# Altium project MFU 1.00.PrjPcb
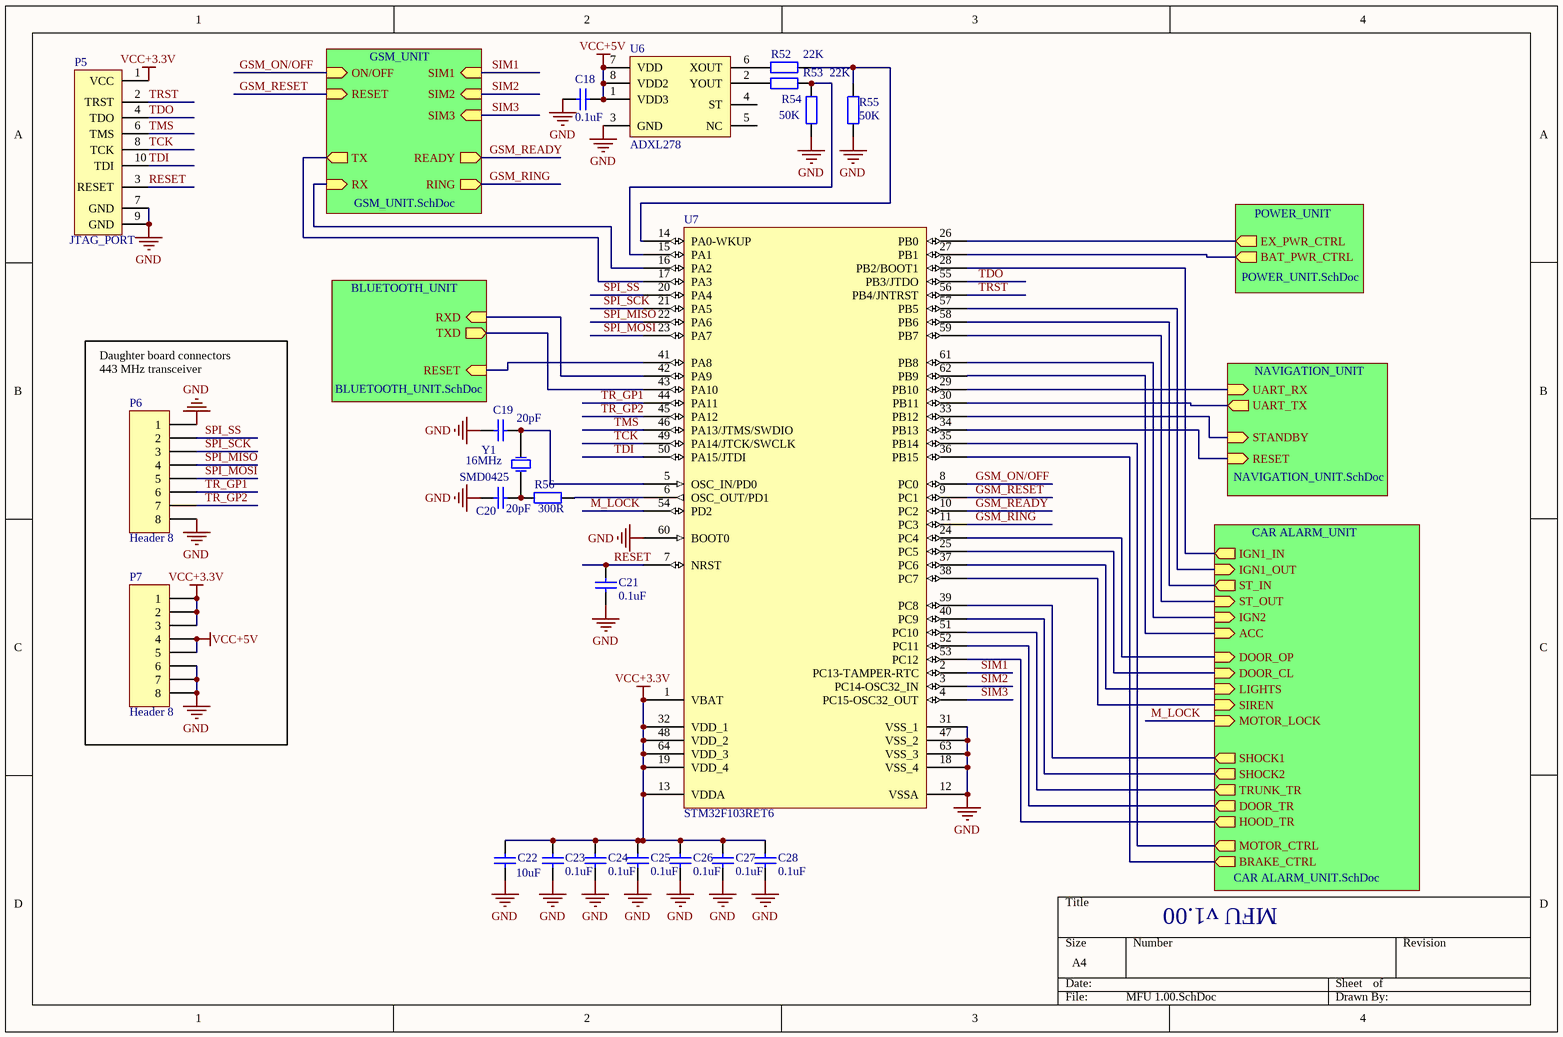
[diagram p0: MFU 1.00.SchDoc]
6 sheets, 195 parts. Net scope: hierarchical (ports join the sheet entries above them; power ports are global).
Board file: MFU 1.00.PcbDoc
Sheets:
  MFU 1.00.SchDoc
    POWER_UNIT = POWER_UNIT.SchDoc
    GSM_UNIT = GSM_UNIT.SchDoc
    NAVIGATION_UNIT = NAVIGATION_UNIT.SchDoc
    BLUETOOTH_UNIT = BLUETOOTH_UNIT.SchDoc
    CAR ALARM_UNIT = CAR ALARM_UNIT.SchDoc

## Sheet MFU 1.00.SchDoc
size A4

### Parts
C18  value 0.1uF  [C0603]  (hidden comment: 0805)
C19  value 20pF  [C0603]  (hidden comment: 0805)
C20  value 20pF  [C0603]  (hidden comment: 0805)
C21  value 0.1uF  [C0603]  (hidden comment: 0805)
C22  value 10uF  [C1210]  (hidden comment: Cap Semi)
C23  value 0.1uF  [C0603]  (hidden comment: 0805)
C24  value 0.1uF  [C0603]  (hidden comment: 0805)
C25  value 0.1uF  [C0603]  (hidden comment: 0805)
C26  value 0.1uF  [C0603]  (hidden comment: 0805)
C27  value 0.1uF  [C0603]  (hidden comment: 0805)
C28  value 0.1uF  [C0603]  (hidden comment: 0805)
P5  JTAG_PORT  [JTAG_connector]
P6  Header 8  [HDR1X8]
P7  Header 8  [HDR1X8]
R52  value 22K  [C0603]  (hidden comment: RES)
R53  value 22K  [C0603]  (hidden comment: RES)
R54  value 50K  [C0603]  (hidden comment: RES)
R55  value 50K  [C0603]  (hidden comment: RES)
R56  value 300R  [C0603]  (hidden comment: RES)
U6  ADXL278  [ADXL278]
U7  STM32F103RET6  [LQFP64_M]
Y1  SMD0425  value 16MHz  [QUARTZ_SMD0425]

### Sub-sheets
BLUETOOTH_UNIT = BLUETOOTH_UNIT.SchDoc: RXD (in), TXD (out), RESET (in)
CAR ALARM_UNIT = CAR ALARM_UNIT.SchDoc: IGN1_IN (out), ST_IN (out), ST_OUT (in), IGN1_OUT (in), IGN2 (in), ACC (in), DOOR_OP (in), DOOR_CL (in), MOTOR_LOCK (in), SIREN (in), LIGHTS (in), MOTOR_CTRL (out), HOOD_TR (out), SHOCK1 (out), SHOCK2 (out), TRUNK_TR (out), DOOR_TR (out), BRAKE_CTRL (out)
GSM_UNIT = GSM_UNIT.SchDoc: SIM1 (in), SIM2 (in), SIM3 (in), ON/OFF (in), RESET (in), READY (out), RING (out), TX (out), RX (in)
NAVIGATION_UNIT = NAVIGATION_UNIT.SchDoc: UART_RX (in), STANDBY (in), RESET (in), UART_TX (out)
POWER_UNIT = POWER_UNIT.SchDoc: EX_PWR_CTRL (out), BAT_PWR_CTRL (out)

### Nets
GND: C18.1 C19.2 C20.2 C21.1 C22.1 C23.1 C24.1 C25.1 C26.1 C27.1 C28.1 P5.7(GND) P5.9(GND) P6.1 P6.8 P7.6 P7.7 P7.8 R54.2 R55.2 U6.3(GND) U7.12(VSSA) U7.18(VSS_4) U7.31(VSS_1) U7.47(VSS_2) U7.60(BOOT0) U7.63(VSS_3)
VCC+3.3V: C22.2 C23.2 C24.2 C25.2 C26.2 C27.2 C28.2 P5.1(VCC) P7.1 P7.2 P7.3 U7.1(VBAT) U7.13(VDDA) U7.19(VDD_4) U7.32(VDD_1) U7.48(VDD_2) U7.64(VDD_3)
VCC+5V: C18.2 P7.4 P7.5 U6.1(VDD3) U6.7(VDD) U6.8(VDD2)
GSM_ON/OFF: U7.8(PC0) ; sheet GSM_UNIT/ON/OFF
GSM_READY: U7.10(PC2) ; sheet GSM_UNIT/READY
GSM_RESET: U7.9(PC1) ; sheet GSM_UNIT/RESET
GSM_RING: U7.11(PC3) ; sheet GSM_UNIT/RING
M_LOCK: U7.54(PD2) ; sheet CAR ALARM_UNIT/MOTOR_LOCK
RESET: C21.2 P5.3(RESET) U7.7(NRST)
SIM1: U7.2(PC13-TAMPER-RTC) ; sheet GSM_UNIT/SIM1
SIM2: U7.3(PC14-OSC32_IN) ; sheet GSM_UNIT/SIM2
SIM3: U7.4(PC15-OSC32_OUT) ; sheet GSM_UNIT/SIM3
SPI_MISO: P6.4 U7.22(PA6)
SPI_MOSI: P6.5 U7.23(PA7)
SPI_SCK: P6.3 U7.21(PA5)
SPI_SS: P6.2 U7.20(PA4)
TCK: P5.8(TCK) U7.49(PA14/JTCK/SWCLK)
TDI: P5.10(TDI) U7.50(PA15/JTDI)
TDO: P5.4(TDO) U7.55(PB3/JTDO)
TMS: P5.6(TMS) U7.46(PA13/JTMS/SWDIO)
TR_GP1: P6.6 U7.44(PA11)
TR_GP2: P6.7 U7.45(PA12)
TRST: P5.2(TRST) U7.56(PB4/JNTRST)
NetC7_1: U7.28(PB2/BOOT1) ; sheet CAR ALARM_UNIT/IGN1_IN
NetC8_1: U7.58(PB6) ; sheet CAR ALARM_UNIT/ST_IN
NetC9_1: U7.35(PB14) ; sheet CAR ALARM_UNIT/MOTOR_CTRL
NetC10_1: U7.36(PB15) ; sheet CAR ALARM_UNIT/BRAKE_CTRL
NetC11_1: U7.53(PC12) ; sheet CAR ALARM_UNIT/HOOD_TR
NetC12_1: U7.52(PC11) ; sheet CAR ALARM_UNIT/DOOR_TR
NetC13_1: U7.51(PC10) ; sheet CAR ALARM_UNIT/TRUNK_TR
NetC14_1: U7.39(PC8) ; sheet CAR ALARM_UNIT/SHOCK1
NetC15_1: U7.40(PC9) ; sheet CAR ALARM_UNIT/SHOCK2
NetC19_1: C19.1 U7.5(OSC_IN/PD0) Y1.3(OSC2)
NetC20_1: C20.1 R56.1 Y1.1(OSC1)
NetQ13_3: U7.17(PA3) ; sheet GSM_UNIT/TX
NetQ14_3: U7.16(PA2) ; sheet GSM_UNIT/RX
NetR6_2: U7.57(PB5) ; sheet CAR ALARM_UNIT/IGN1_OUT
NetR7_2: U7.61(PB8) ; sheet CAR ALARM_UNIT/IGN2
NetR8_2: U7.62(PB9) ; sheet CAR ALARM_UNIT/ACC
NetR14_2: U7.25(PC5) ; sheet CAR ALARM_UNIT/DOOR_CL
NetR16_2: U7.24(PC4) ; sheet CAR ALARM_UNIT/DOOR_OP
NetR22_2: U7.59(PB7) ; sheet CAR ALARM_UNIT/ST_OUT
NetR36_2: U7.38(PC7) ; sheet CAR ALARM_UNIT/SIREN
NetR40_2: U7.37(PC6) ; sheet CAR ALARM_UNIT/LIGHTS
NetR52_1: R52.1 R55.1 U7.14(PA0-WKUP)
NetR52_2: R52.2 U6.6(XOUT)
NetR53_1: R53.1 R54.1 U7.15(PA1)
NetR53_2: R53.2 U6.2(YOUT)
NetR56_2: R56.2 U7.6(OSC_OUT/PD1)
NetR57_1: U7.29(PB10) ; sheet NAVIGATION_UNIT/UART_RX
NetR58_1: U7.30(PB11) ; sheet NAVIGATION_UNIT/UART_TX
NetR59_1: U7.33(PB12) ; sheet NAVIGATION_UNIT/STANDBY
NetR60_1: U7.34(PB13) ; sheet NAVIGATION_UNIT/RESET
NetR63_1: U7.26(PB0) ; sheet POWER_UNIT/EX_PWR_CTRL
NetR70_1: U7.27(PB1) ; sheet POWER_UNIT/BAT_PWR_CTRL
NetU1_2: U7.41(PA8) ; sheet BLUETOOTH_UNIT/RESET
NetU1_12: U7.42(PA9) ; sheet BLUETOOTH_UNIT/RXD
NetU1_13: U7.43(PA10) ; sheet BLUETOOTH_UNIT/TXD

Not connected (* = marked no-connect by the designer): U6 4(ST) 5(NC)

### Notes on the sheet
- (near P6) Daughter board connectors
  443 MHz transceiver
- MFU v1.00

### Library data of the parts
C18-C21 C23-C28 = Capasitor_SMD_0805: Capasitor_SMD_0808/
C22 = Cap Semi: Capacitor (Semiconductor SIM Model); Published: 8-Jun-2000; LatestRevisionDate: 29-May-2009; LatestRevisionNote: IPC-7351 Footprint Added.; PackageReference: C1206; Publisher: Altium Limited; PackageDescription: Chip Capacitor
P6 P7 = Header 8: Header, 8-Pin; LatestRevisionDate: 17-Jul-2002; LatestRevisionNote: Re-released for DXP Platform.; Publisher: Altium Limited
R52-R56 = RES: Resistor
U7 = STM32F103RBT6: STM32 ARM-based 32-bit MCU with 512 Kbytes Flash, 64-pin LQFP, Industrial Temperature; Published: 30-May-2008; DatasheetVersion: rev6, Mar-2008; PackageVersion: Mar-2008; PackageReference: LQFP64; Publisher: Altium Limited; PackageDescription: 64-Pin Low-Profile Quad Flat Pack, 10 x 10 mm Body, 0.5 mm Pitch (LQFP64); ComponentLink1Description: Manufacturer Link; ComponentLink1URL: www.st.com/stm32; ComponentLink2Description: Datasheet; ComponentLink2URL: http://www.st.com/stonline/products/literature/ds/13587.pdf
Y1 = Quartz_SMD

## Sheet POWER_UNIT.SchDoc
size A4
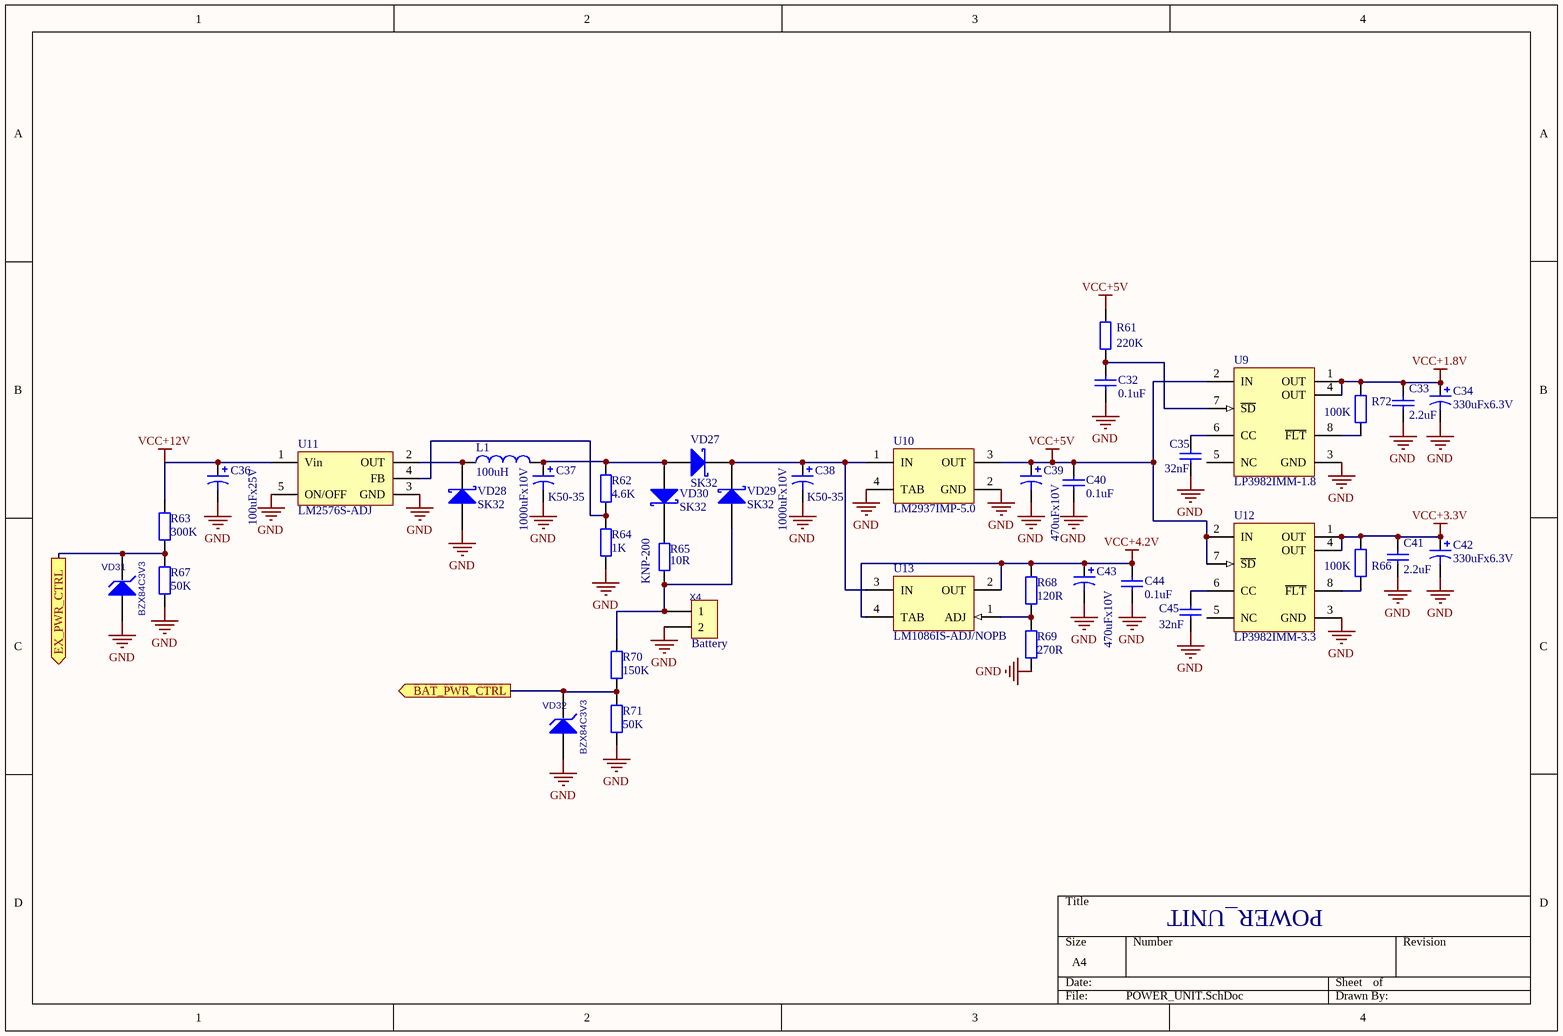
[diagram p1: POWER_UNIT.SchDoc]

### Parts
C32  value 0.1uF  [C0603]  (hidden comment: 0805)
C33  value 2.2uF  [C0603]  (hidden comment: 0805)
C34  value 330uFx6.3V  [Capasitor_POL_SMD D6.3]  (hidden comment: SMD_cap)
C35  value 32nF  [C0603]  (hidden comment: 0805)
C36  value 100uFx25V  [CAP_POL_D6.3]  (hidden comment: K50-35)
C37  K50-35  value 1000uFx10V  [CAP_POL_D10]
C38  K50-35  value 1000uFx10V  [CAP_POL_D10]
C39  value 470uFx10V  [Capasitor_POL_SMD D8]  (hidden comment: SMD_cap)
C40  value 0.1uF  [C0603]  (hidden comment: 0805)
C41  value 2.2uF  [C0603]  (hidden comment: 0805)
C42  value 330uFx6.3V  [Capasitor_POL_SMD D6.3]  (hidden comment: SMD_cap)
C43  value 470uFx10V  [Capasitor_POL_SMD D8]  (hidden comment: SMD_cap)
C44  value 0.1uF  [C0603]  (hidden comment: 0805)
C45  value 32nF  [C0603]  (hidden comment: 0805)
L1  value 100uH  [Inductor_SMD_12.5x12.5]  (hidden comment: B82477P4)
R61  value 220K  [C0603]  (hidden comment: RES)
R62  value 4.6K  [C0603]  (hidden comment: RES)
R63  value 300K  [C0603]  (hidden comment: RES)
R64  value 1K  [C0603]  (hidden comment: RES)
R65  KNP-200  value 10R  [Resistor KNP-200]
R66  value 100K  [C0603]  (hidden comment: RES)
R67  value 50K  [C0603]  (hidden comment: RES)
R68  value 120R  [C0805]  (hidden comment: RES)
R69  value 270R  [C0805]  (hidden comment: RES)
R70  value 150K  [C0603]  (hidden comment: RES)
R71  value 50K  [C0603]  (hidden comment: RES)
R72  value 100K  [C0603]  (hidden comment: RES)
U9  LP3982IMM-1.8  [MUA08A_N]
U10  LM2937IMP-5.0  [MP04A_N]
U11  LM2576S-ADJ  [TO-263-5]
U12  LP3982IMM-3.3  [MUA08A_N]
U13  LM1086IS-ADJ/NOPB  [TS3B_N]
VD27  SK32  [SMC]
VD28  SK32  [SMC]
VD29  SK32  [SMC]
VD30  SK32  [SMC]
VD31  BZX84C3V3  [SOT23]
VD32  BZX84C3V3  [SOT23]
X4  value Battery  [DG350-3.5-2P]  (hidden comment: DG350-3.5-2P)

### Ports
BAT_PWR_CTRL (out), EX_PWR_CTRL (out)

### Nets
GND: C32.2 C33.2 C34.2 C35.2 C36.2 C37.2 C38.2 C39.2 C40.2 C41.2 C42.2 C43.2 C44.2 C45.2 R64.1 R67.1 R69.1 R71.1 U9.3(GND) U10.2(GND) U10.4(TAB) U11.3(GND) U11.5(ON/OFF) U12.3(GND) VD28.2(A) VD31.1(A) VD32.1(A) X4.2
VCC+1.8V: C33.1 C34.1 R72.2 U9.1(OUT) U9.4(OUT)
VCC+3.3V: C41.1 C42.1 R66.2 U12.1(OUT) U12.4(OUT)
VCC+4.2V: C43.1 C44.1 R68.2 U13.2(OUT) U13.4(TAB)
VCC+5V: C39.1 C40.1 R61.2 U9.2(IN) U10.3(OUT) U12.2(IN) U12.7(~{SD})
VCC+12V: C36.1 R63.2 U11.1(Vin)
NetC32_1: C32.1 R61.1 U9.7(~{SD})
NetC35_1: C35.1 U9.6(CC)
NetC37_1: C37.1 L1.2 R62.2 VD27.2(A) VD30.2(A)
NetC38_1: C38.1 U10.1(IN) U13.3(IN) VD27.1(K) VD29.1(K)
NetC45_1: C45.1 U12.6(CC)
NetL1_1: L1.1 U11.2(OUT) VD28.1(K)
NetR62_1: R62.1 R64.2 U11.4(FB)
NetR63_1: R63.1 R67.2 VD31.3(K) ; port EX_PWR_CTRL
NetR65_1: R65.1 R70.2 VD29.2(A) X4.1
NetR65_2: R65.2 VD30.1(K)
NetR66_1: R66.1 U12.8(~{FLT})
NetR68_1: R68.1 R69.2 U13.1(ADJ)
NetR70_1: R70.1 R71.2 VD32.3(K) ; port BAT_PWR_CTRL
NetR72_1: R72.1 U9.8(~{FLT})

Not connected (* = marked no-connect by the designer): U9 5(NC); U12 5(NC); VD31 2; VD32 2

### Notes on the sheet
- POWER_UNIT

### Library data of the parts
C32 C33 C35 C40 C41 C44 C45 = Capasitor_SMD_0805: Capasitor_SMD_0808/
C34 C42 = Capasitor_POL_SMD D8.0
C36 = Capasitor_pol D6.3
C37 C38 = Capasitor_pol D10
C39 C43 = Capasitor_POL_SMD D8.0: size 8x10.5
R61-R64 R66-R72 = RES: Resistor
R65 = Resistor 2W
U9 = LP3982IMM-1.8: Micropower, Ultra Low-Dropout, Low-Noise, 300mA CMOS Regulator, 8-pin Mini SOIC; Manufacturer: National Semiconductor; PackageTopMarking: ZXTT*LENB; PowerWise: N; CompType: LDO IC; Published: 4-Dec-2008; DatasheetVersion: Mar-2006; PackageVersion: revF, Apr-2008; PackageReference: MUA08A; Publisher: Altium Limited; PackageDescription: MINI SOIC, .118 x .118 x .034in, 8 Lead, .0256in Pitch; PartNumber: LP3982IMM-1.8; RoHS: N; PinCount: 8; Code_JEDEC: MO-187-AA; ComponentLink1Description: LP3982 Datasheet; ComponentLink1URL: http://www.national.com/ds/LP/LP3982.pdf; ComponentLink2Description: LP3982 Web Page; ComponentLink2URL: http://www.national.com/pf/LP/LP3982.html; ComponentLink3Description: MUA08A Package Page; ComponentLink3URL: http://www.national.com/packaging/folders/mua08a.html
U10 = LM2937IMP-5.0: 500 mA Low Dropout Regulator, 4-pin SOT-223; Manufacturer: National Semiconductor; PackageTopMarking: XYTT*L71B; PowerWise: N; CompType: LDO IC; Published: 4-Dec-2008; DatasheetVersion: Aug-2005; PackageVersion: revB, Apr-2003; PackageReference: MP04A; Publisher: Altium Limited; PackageDescription: Molded SOT-223, 6.50 x 3.56 x 1.6mm Body, 4 Lead, 2.3mm Pitch; Supplier 1: Farnell; Supplier Part Number 1: 3331209; PartNumber: LM2937IMP-5.0; RoHS: N; PinCount: 4; Code_JEDEC: TO-261-AA; Code_IPC: SOT223-4; ComponentLink1Description: LM2937 Datasheet; ComponentLink1URL: http://www.national.com/ds/LM/LM2937.pdf; ComponentLink2Description: LM2937 Web Page; ComponentLink2URL: http://www.national.com/pf/LM/LM2937.html; ComponentLink3Description: MP04A Package Page; ComponentLink3URL: http://www.national.com/packaging/folders/mp04a.html
U12 = LP3982IMM-3.3: Micropower, Ultra Low-Dropout, Low-Noise, 300mA CMOS Regulator, 8-pin Mini SOIC; Manufacturer: National Semiconductor; PackageTopMarking: ZXTT*LEUB; PowerWise: N; CompType: LDO IC; Published: 4-Dec-2008; DatasheetVersion: Mar-2006; PackageVersion: revF, Apr-2008; PackageReference: MUA08A; Publisher: Altium Limited; PackageDescription: MINI SOIC, .118 x .118 x .034in, 8 Lead, .0256in Pitch; Supplier 1: Farnell; Supplier Part Number 1: 9779590; PartNumber: LP3982IMM-3.3; RoHS: N; PinCount: 8; Code_JEDEC: MO-187-AA; ComponentLink1Description: LP3982 Datasheet; ComponentLink1URL: http://www.national.com/ds/LP/LP3982.pdf; ComponentLink2Description: LP3982 Web Page; ComponentLink2URL: http://www.national.com/pf/LP/LP3982.html; ComponentLink3Description: MUA08A Package Page; ComponentLink3URL: http://www.national.com/packaging/folders/mua08a.html
U13 = LM1086IS-ADJ/NOPB: 1.5A Low Dropout Positive Regulators, 3-pin TO-263, Pb-Free; Manufacturer: National Semiconductor; PackageTopMarking: NSUZXYTTE#*LM1086*IS-ADJ; PowerWise: N; CompType: LDO IC; Published: 1-Mar-2010; DatasheetVersion: Jun-2005; PackageVersion: revF, Apr-2005; PackageReference: TS3B; Publisher: Altium Limited; PackageDescription: TO-263, Molded, .400 x .390 x .180in, 3 Lead, .1in Pitch, Surface Mount; Supplier 1: Digi-Key; Supplier Part Number 1: LM1086IS-ADJ-ND; Supplier 2: Farnell; Supplier Part Number 2: 1469045; PartNumber: LM1086IS-ADJ/NOPB; RoHS: Y; PinCount: 3; Code_JEDEC: MO-169-AA; ComponentLink1Description: LM1086 Datasheet; ComponentLink1URL: http://www.national.com/ds/LM/LM1086.pdf; ComponentLink2Description: LM1086 Web Page; ComponentLink2URL: http://www.national.com/pf/LM/LM1086.html; ComponentLink3Description: TS3B Package Page; ComponentLink3URL: http://www.national.com/packaging/folders/ts3b.html
VD31 VD32 = BZX84C: Value: *

## Sheet GSM_UNIT.SchDoc
size A4
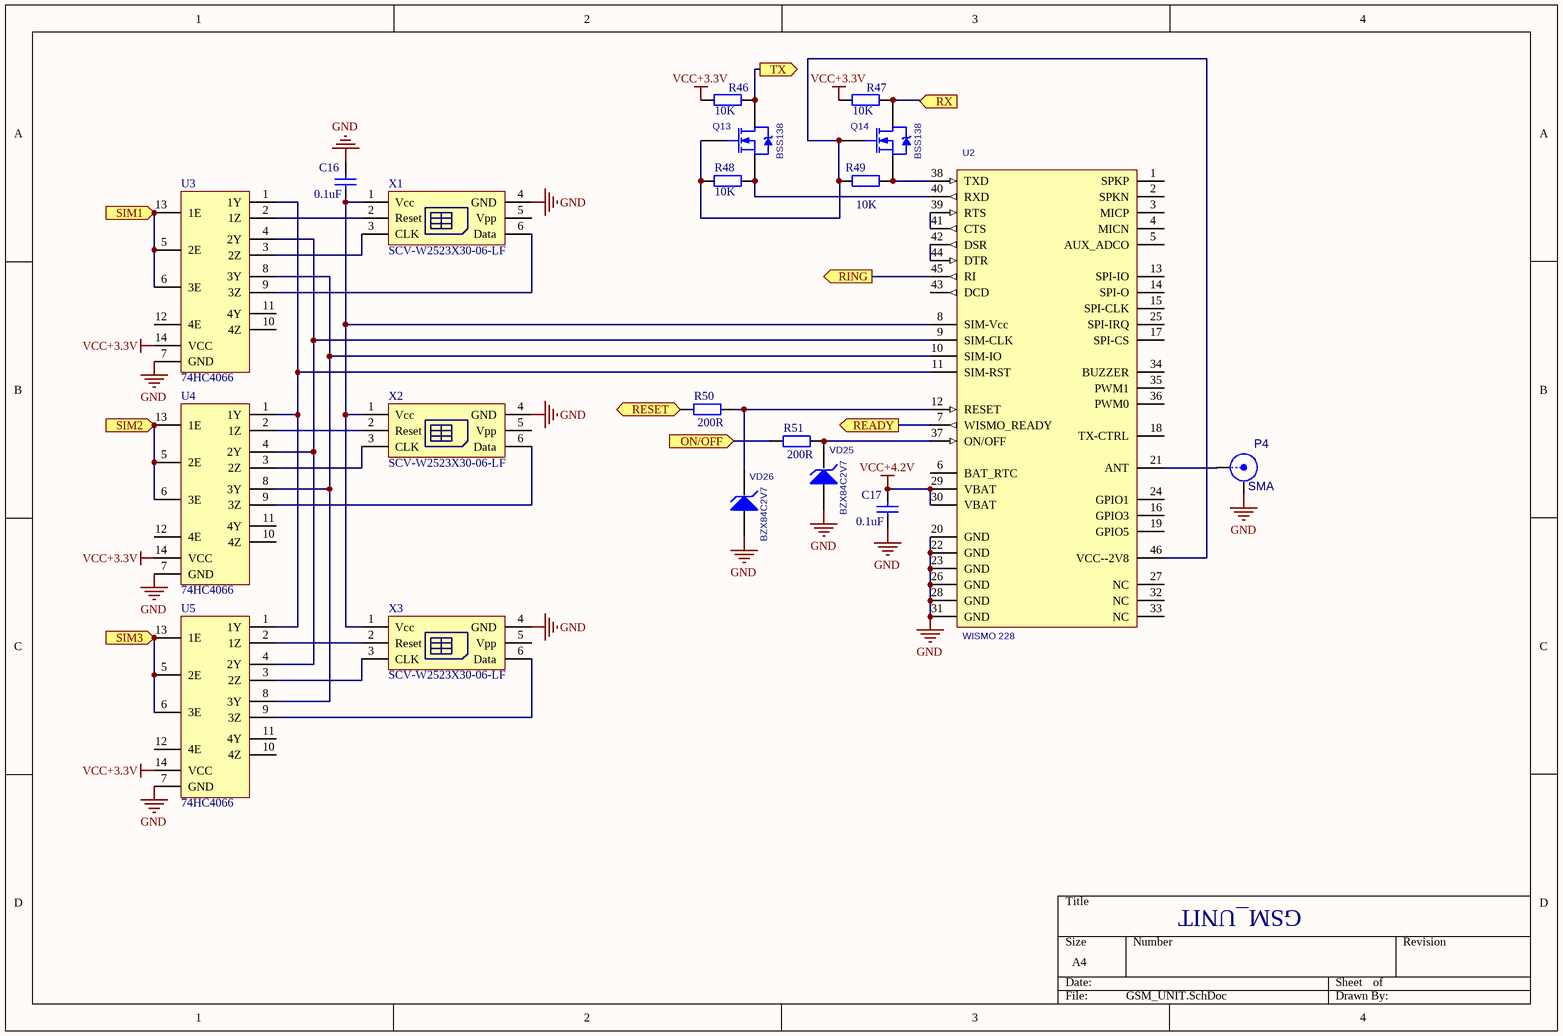
[diagram p2: GSM_UNIT.SchDoc]

### Parts
C16  value 0.1uF  [C0603]  (hidden comment: 0805)
C17  value 0.1uF  [C0603]  (hidden comment: 0805)
P4  SMA  [SMA]
Q13  BSS138  [SOT23]
Q14  BSS138  [SOT23]
R46  value 10K  [C0603]  (hidden comment: RES)
R47  value 10K  [C0603]  (hidden comment: RES)
R48  value 10K  [C0603]  (hidden comment: RES)
R49  value 10K  [C0603]  (hidden comment: RES)
R50  value 200R  [C0603]  (hidden comment: RES)
R51  value 200R  [C0603]  (hidden comment: RES)
U2  WISMO 228  [WISMO]
U3  74HC4066  [SO-14]
U4  74HC4066  [SO-14]
U5  74HC4066  [SO-14]
VD25  BZX84C2V7  [SOT23]
VD26  BZX84C2V7  [SOT23]
X1  SCV-W2523X30-06-LF  [SCV-W2523X30-06-LF]
X2  SCV-W2523X30-06-LF  [SCV-W2523X30-06-LF]
X3  SCV-W2523X30-06-LF  [SCV-W2523X30-06-LF]

### Ports
ON/OFF (in), READY (out), RESET (in), RING (out), RX (in), SIM1 (in), SIM2 (in), SIM3 (in), TX (out)

### Nets
GND: C16.1 C17.2 P4.2(Y) U2.20(GND) U2.22(GND) U2.23(GND) U2.26(GND) U2.28(GND) U2.31(GND) U3.7(GND) U4.7(GND) U5.7(GND) VD25.1(A) VD26.1(A) X1.4(GND) X2.4(GND) X3.4(GND)
VCC+3.3V: R46.1 R47.1 U3.14(VCC) U4.14(VCC) U5.14(VCC)
VCC+4.2V: C17.1 U2.29(VBAT) U2.30(VBAT)
GSM_ON/OFF: R51.1 ; port ON/OFF
GSM_READY: U2.7(WISMO_READY) ; port READY
GSM_RESET: R50.1 ; port RESET
GSM_RING: U2.45(RI) ; port RING
SIM1: U3.5(2E) U3.6(3E) U3.13(1E) ; port SIM1
SIM2: U4.5(2E) U4.6(3E) U4.13(1E) ; port SIM2
SIM3: U5.5(2E) U5.6(3E) U5.13(1E) ; port SIM3
NetC16_2: C16.2 U2.8(SIM-Vcc) X1.1(Vcc) X2.1(Vcc) X3.1(Vcc)
NetP4_1: P4.1(X) U2.21(ANT)
NetQ13_1: Q13.1(G) Q14.1(G) R48.1 R49.1 U2.46(VCC--2V8)
NetQ13_2: Q13.2(S) R48.2 U2.40(RXD)
NetQ13_3: Q13.3(D) R46.2 ; port TX
NetQ14_2: Q14.2(S) R49.2 U2.38(TXD)
NetQ14_3: Q14.3(D) R47.2 ; port RX
NetR50_2: R50.2 U2.12(RESET) VD26.3(K)
NetR51_2: R51.2 U2.37(ON/OFF) VD25.3(K)
NetU2_9: U2.9(SIM-CLK) U3.4(2Y) U4.4(2Y) U5.4(2Y)
NetU2_10: U2.10(SIM-IO) U3.8(3Y) U4.8(3Y) U5.8(3Y)
NetU2_11: U2.11(SIM-RST) U3.1(1Y) U4.1(1Y) U5.1(1Y)
NetU2_39: U2.39(RTS) U2.41(CTS)
NetU2_42: U2.42(DSR) U2.44(DTR)
NetU3_2: U3.2(1Z) X1.2(Reset)
NetU3_3: U3.3(2Z) X1.3(CLK)
NetU3_9: U3.9(3Z) X1.6(Data)
NetU4_2: U4.2(1Z) X2.2(Reset)
NetU4_3: U4.3(2Z) X2.3(CLK)
NetU4_9: U4.9(3Z) X2.6(Data)
NetU5_2: U5.2(1Z) X3.2(Reset)
NetU5_3: U5.3(2Z) X3.3(CLK)
NetU5_9: U5.9(3Z) X3.6(Data)

Not connected (* = marked no-connect by the designer): U2 1(SPKP) 2(SPKN) 3(MICP) 4(MICN) 5(AUX_ADCO) 6(BAT_RTC) 13(SPI-IO) 14(SPI-O) 15(SPI-CLK) 16(GPIO3) 17(SPI-CS) 18(TX-CTRL) 19(GPIO5) 24(GPIO1) 25(SPI-IRQ) 27(NC) 32(NC) 33(NC) 34(BUZZER) 35(PWM1) 36(PWM0) 43(DCD); U3 10(4Z) 11(4Y) 12(4E); U4 10(4Z) 11(4Y) 12(4E); U5 10(4Z) 11(4Y) 12(4E); VD25 2; VD26 2; X1 5(Vpp); X2 5(Vpp); X3 5(Vpp)

### Notes on the sheet
- GSM_UNIT

### Library data of the parts
C16 C17 = Capasitor_SMD_0805: Capasitor_SMD_0808/
Q13 Q14 = BSS138-SOT23
R46-R51 = RES: Resistor
VD25 VD26 = BZX84C: Value: *
X1-X3 = SCV-W2523X30-06-LF: SIM Cartreader
P4 = SMA: LatestRevisionDate: 17-Jul-2002; Publisher: Altium Limited; LatestRevisionNote: Re-released for DXP Platform.; Value: *

## Sheet NAVIGATION_UNIT.SchDoc
size A4
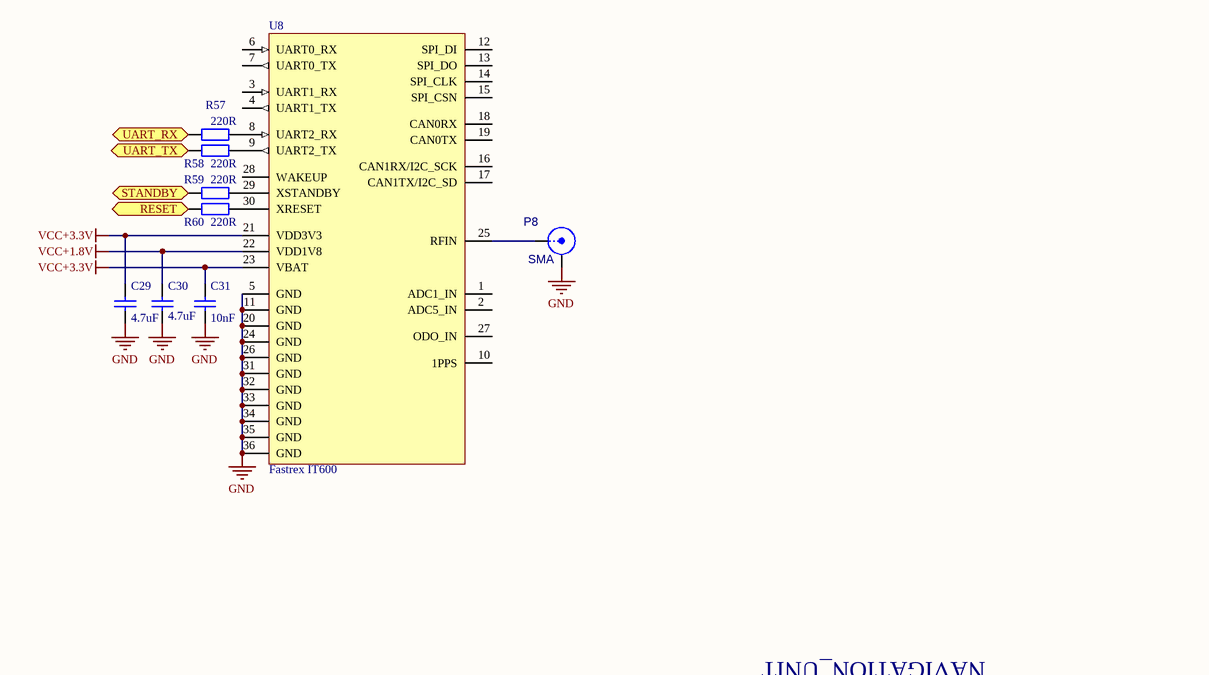
[diagram p3: NAVIGATION_UNIT.SchDoc]

### Parts
C29  value 4.7uF  [C0805]  (hidden comment: 0805)
C30  value 4.7uF  [C0805]  (hidden comment: 0805)
C31  value 10nF  [C0603]  (hidden comment: 0805)
P8  SMA  [SMA]
R57  value 220R  [C0603]  (hidden comment: RES)
R58  value 220R  [C0603]  (hidden comment: RES)
R59  value 220R  [C0603]  (hidden comment: RES)
R60  value 220R  [C0603]  (hidden comment: RES)
U8  Fastrex IT600  [Fastrex_IT600]

### Ports
RESET (in), STANDBY (in), UART_RX (in), UART_TX (out)

### Nets
GND: C29.2 C30.2 C31.2 P8.2(Y) U8.5(GND) U8.11(GND) U8.20(GND) U8.24(GND) U8.26(GND) U8.31(GND) U8.32(GND) U8.33(GND) U8.34(GND) U8.35(GND) U8.36(GND)
VCC+1.8V: C30.1 U8.22(VDD1V8)
VCC+3.3V: C29.1 C31.1 U8.21(VDD3V3) U8.23(VBAT)
NetP8_1: P8.1(X) U8.25(RFIN)
NetR57_1: R57.1 ; port UART_RX
NetR57_2: R57.2 U8.8(UART2_RX)
NetR58_1: R58.1 ; port UART_TX
NetR58_2: R58.2 U8.9(UART2_TX)
NetR59_1: R59.1 ; port STANDBY
NetR59_2: R59.2 U8.29(XSTANDBY)
NetR60_1: R60.1 ; port RESET
NetR60_2: R60.2 U8.30(XRESET)

Not connected (* = marked no-connect by the designer): U8 1(ADC1_IN) 2(ADC5_IN) 3(UART1_RX) 4(UART1_TX) 6(UART0_RX) 7(UART0_TX) 10(1PPS) 12(SPI_DI) 13(SPI_DO) 14(SPI_CLK) 15(SPI_CSN) 16(CAN1RX/I2C_SCK) 17(CAN1TX/I2C_SD) 18(CAN0RX) 19(CAN0TX) 27(ODO_IN) 28(WAKEUP)

### Notes on the sheet
- NAVIGATION_UNIT

### Library data of the parts
C29-C31 = Capasitor_SMD_0805: Capasitor_SMD_0808/
R57-R60 = RES: Resistor
U8 = Fastrax IT600: GPS/ГЛОНАСС
P8 = SMA: LatestRevisionDate: 17-Jul-2002; Publisher: Altium Limited; LatestRevisionNote: Re-released for DXP Platform.; Value: *

## Sheet BLUETOOTH_UNIT.SchDoc
size A4
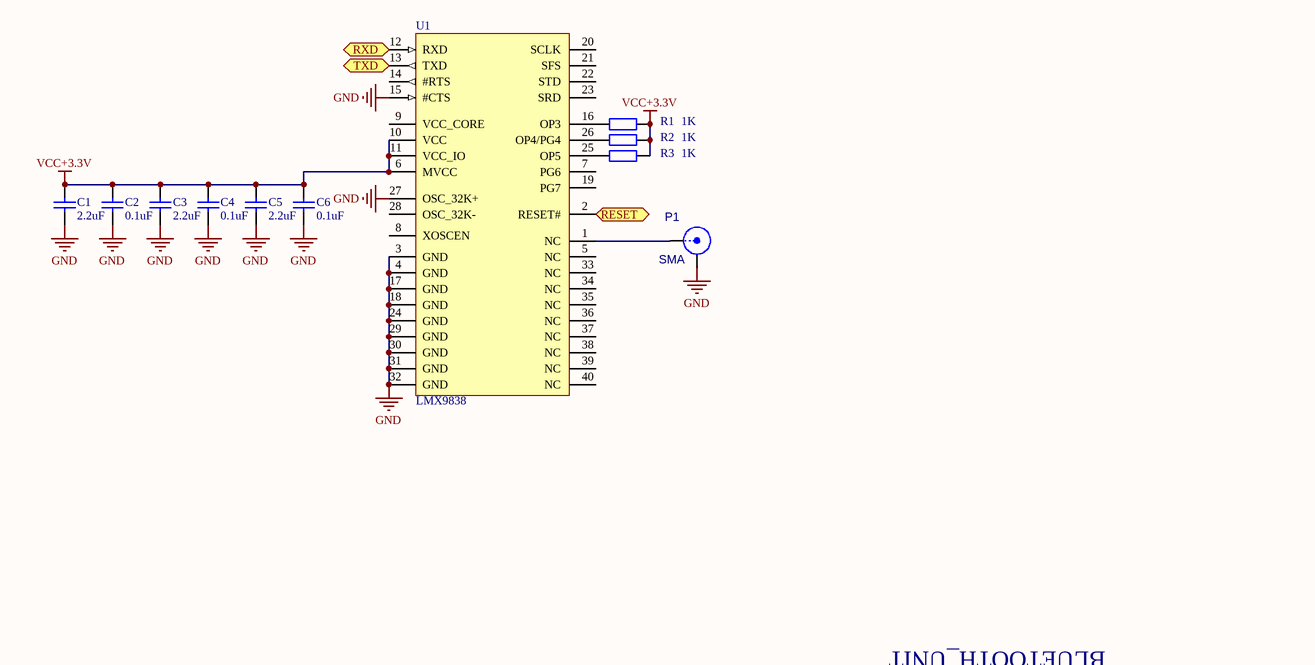
[diagram p4: BLUETOOTH_UNIT.SchDoc]

### Parts
C1  value 2.2uF  [C0603]  (hidden comment: 0805)
C2  value 0.1uF  [C0603]  (hidden comment: 0805)
C3  value 2.2uF  [C0603]  (hidden comment: 0805)
C4  value 0.1uF  [C0603]  (hidden comment: 0805)
C5  value 2.2uF  [C0603]  (hidden comment: 0805)
C6  value 0.1uF  [C0603]  (hidden comment: 0805)
P1  SMA  [SMA]
R1  value 1K  [C0603]  (hidden comment: RES)
R2  value 1K  [C0603]  (hidden comment: RES)
R3  value 1K  [C0603]  (hidden comment: RES)
U1  LMX9838  [LMX9838]

### Ports
RESET (in), RXD (in), TXD (out)

### Nets
GND: C1.2 C2.2 C3.2 C4.2 C5.2 C6.2 P1.2(Y) U1.3(GND) U1.4(GND) U1.15(#CTS) U1.17(GND) U1.18(GND) U1.24(GND) U1.27(OSC_32K+) U1.29(GND) U1.30(GND) U1.31(GND) U1.32(GND)
VCC+3.3V: C1.1 C2.1 C3.1 C4.1 C5.1 C6.1 R1.2 R2.2 R3.2 U1.6(MVCC) U1.10(VCC) U1.11(VCC_IO)
NetP1_1: P1.1(X) U1.1(NC)
NetR1_1: R1.1 U1.16(OP3)
NetR2_1: R2.1 U1.26(OP4/PG4)
NetR3_1: R3.1 U1.25(OP5)
NetU1_2: U1.2(RESET#) ; port RESET
NetU1_12: U1.12(RXD) ; port RXD
NetU1_13: U1.13(TXD) ; port TXD

Not connected (* = marked no-connect by the designer): U1 5(NC) 7(PG6) 8(XOSCEN) 9(VCC_CORE) 14(#RTS) 19(PG7) 20(SCLK) 21(SFS) 22(STD) 23(SRD) 28(OSC_32K-) 33(NC) 34(NC) 35(NC) 36(NC) 37(NC) 38(NC) 39(NC) 40(NC)

### Notes on the sheet
- BLUETOOTH_UNIT

### Library data of the parts
C1-C6 = Capasitor_SMD_0805: Capasitor_SMD_0808/
R1-R3 = RES: Resistor
U1 = LMX9838: Bluetooth module
P1 = SMA: LatestRevisionDate: 17-Jul-2002; Publisher: Altium Limited; LatestRevisionNote: Re-released for DXP Platform.; Value: *

## Sheet CAR ALARM_UNIT.SchDoc
size A3
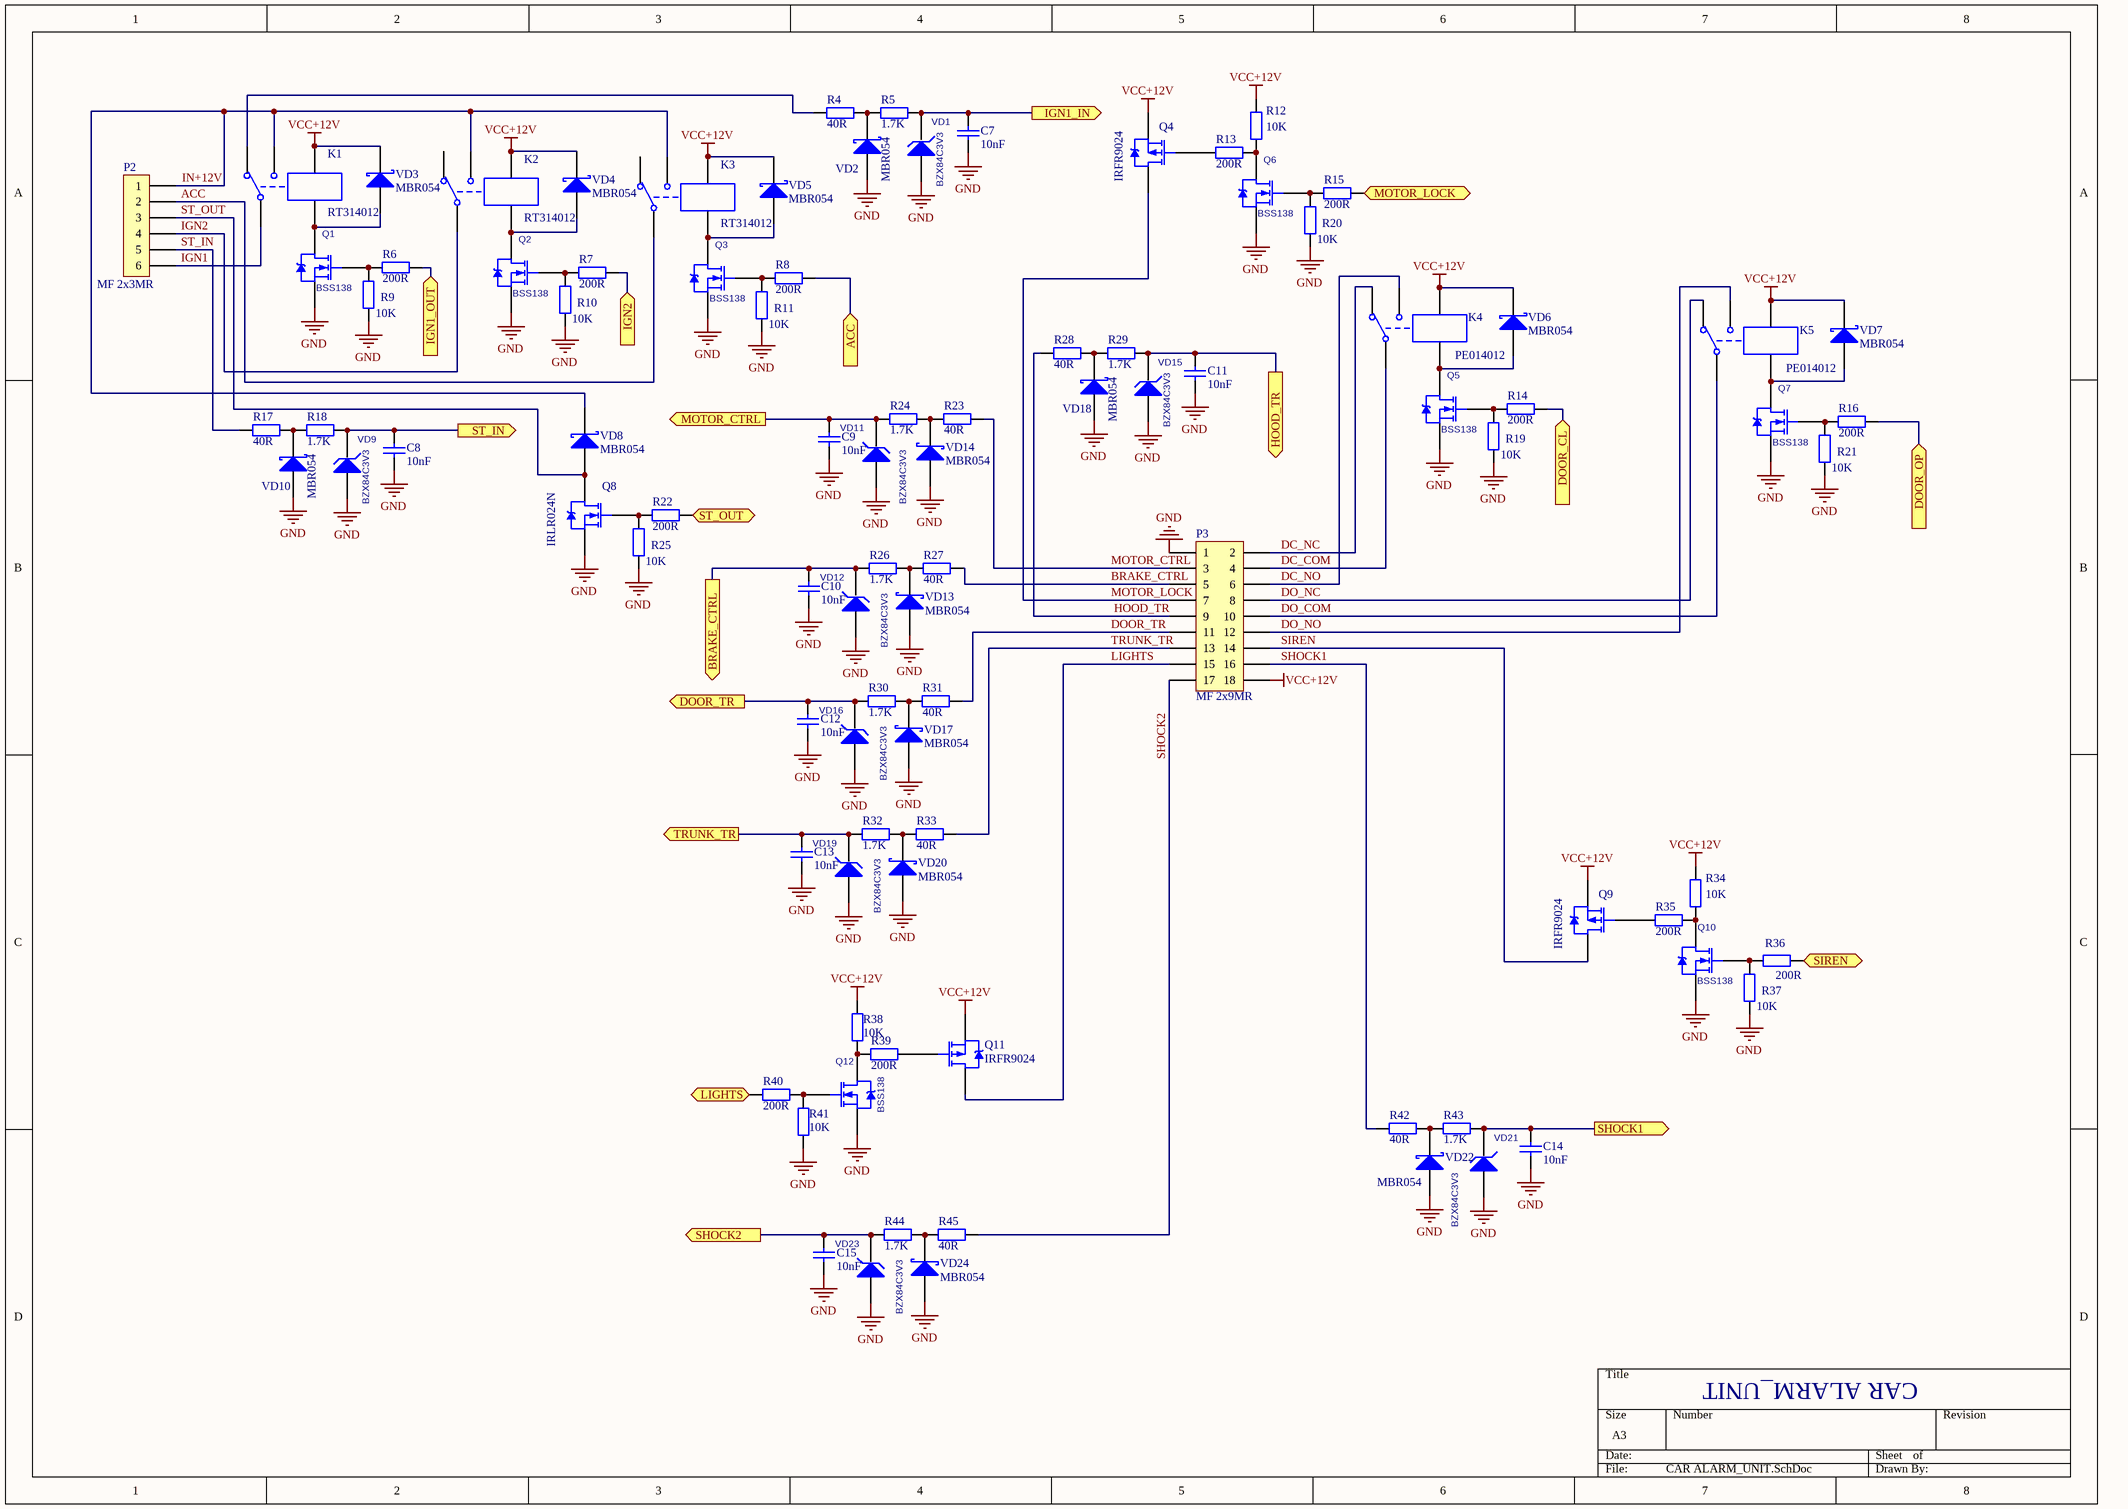
[diagram p5: CAR ALARM_UNIT.SchDoc]

### Parts
C7  value 10nF  [C0603]  (hidden comment: 0805)
C8  value 10nF  [C0603]  (hidden comment: 0805)
C9  value 10nF  [C0603]  (hidden comment: 0805)
C10  value 10nF  [C0603]  (hidden comment: 0805)
C11  value 10nF  [C0603]  (hidden comment: 0805)
C12  value 10nF  [C0603]  (hidden comment: 0805)
C13  value 10nF  [C0603]  (hidden comment: 0805)
C14  value 10nF  [C0603]  (hidden comment: 0805)
C15  value 10nF  [C0603]  (hidden comment: 0805)
K1  RT314012  [RT314012]
K2  RT314012  [RT314012]
K3  RT314012  [RT314012]
K4  PE014012  [PE014012]
K5  PE014012  [PE014012]
P2  MF 2x3MR  [MF 2x3MR]
P3  MF 2x9MR  [MF 2x9MR]
Q1  BSS138  [SOT23]
Q2  BSS138  [SOT23]
Q3  BSS138  [SOT23]
Q4  IRFR9024  [TO-252AA_M]
Q5  BSS138  [SOT23]
Q6  BSS138  [SOT23]
Q7  BSS138  [SOT23]
Q8  IRLR024N  [TO-252AA_M]
Q9  IRFR9024  [TO-252AA_M]
Q10  BSS138  [SOT23]
Q11  IRFR9024  [TO-252AA_M]
Q12  BSS138  [SOT23]
R4  value 40R  [C0805]  (hidden comment: RES)
R5  value 1.7K  [C0805]  (hidden comment: RES)
R6  value 200R  [C0603]  (hidden comment: RES)
R7  value 200R  [C0603]  (hidden comment: RES)
R8  value 200R  [C0603]  (hidden comment: RES)
R9  value 10K  [C0603]  (hidden comment: RES)
R10  value 10K  [C0603]  (hidden comment: RES)
R11  value 10K  [C0603]  (hidden comment: RES)
R12  value 10K  [C0805]  (hidden comment: RES)
R13  value 200R  [C0805]  (hidden comment: RES)
R14  value 200R  [C0603]  (hidden comment: RES)
R15  value 200R  [C0603]  (hidden comment: RES)
R16  value 200R  [C0603]  (hidden comment: RES)
R17  value 40R  [C0805]  (hidden comment: RES)
R18  value 1.7K  [C0805]  (hidden comment: RES)
R19  value 10K  [C0603]  (hidden comment: RES)
R20  value 10K  [C0603]  (hidden comment: RES)
R21  value 10K  [C0603]  (hidden comment: RES)
R22  value 200R  [C0805]  (hidden comment: RES)
R23  value 40R  [C0805]  (hidden comment: RES)
R24  value 1.7K  [C0805]  (hidden comment: RES)
R25  value 10K  [C0805]  (hidden comment: RES)
R26  value 1.7K  [C0805]  (hidden comment: RES)
R27  value 40R  [C0805]  (hidden comment: RES)
R28  value 40R  [C0805]  (hidden comment: RES)
R29  value 1.7K  [C0805]  (hidden comment: RES)
R30  value 1.7K  [C0805]  (hidden comment: RES)
R31  value 40R  [C0805]  (hidden comment: RES)
R32  value 1.7K  [C0805]  (hidden comment: RES)
R33  value 40R  [C0805]  (hidden comment: RES)
R34  value 10K  [C0805]  (hidden comment: RES)
R35  value 200R  [C0805]  (hidden comment: RES)
R36  value 200R  [C0603]  (hidden comment: RES)
R37  value 10K  [C0603]  (hidden comment: RES)
R38  value 10K  [C0805]  (hidden comment: RES)
R39  value 200R  [C0805]  (hidden comment: RES)
R40  value 200R  [C0603]  (hidden comment: RES)
R41  value 10K  [C0603]  (hidden comment: RES)
R42  value 40R  [C0805]  (hidden comment: RES)
R43  value 1.7K  [C0805]  (hidden comment: RES)
R44  value 1.7K  [C0805]  (hidden comment: RES)
R45  value 40R  [C0805]  (hidden comment: RES)
VD1  BZX84C3V3  [SOT23]
VD2  MBR054  [SOD-123]
VD3  MBR054  [SOD-123]
VD4  MBR054  [SOD-123]
VD5  MBR054  [SOD-123]
VD6  MBR054  [SOD-123]
VD7  MBR054  [SOD-123]
VD8  MBR054  [SOD-123]
VD9  BZX84C3V3  [SOT23]
VD10  MBR054  [SOD-123]
VD11  BZX84C3V3  [SOT23]
VD12  BZX84C3V3  [SOT23]
VD13  MBR054  [SOD-123]
VD14  MBR054  [SOD-123]
VD15  BZX84C3V3  [SOT23]
VD16  BZX84C3V3  [SOT23]
VD17  MBR054  [SOD-123]
VD18  MBR054  [SOD-123]
VD19  BZX84C3V3  [SOT23]
VD20  MBR054  [SOD-123]
VD21  BZX84C3V3  [SOT23]
VD22  MBR054  [SOD-123]
VD23  BZX84C3V3  [SOT23]
VD24  MBR054  [SOD-123]

### Ports
ACC (in), BRAKE_CTRL (out), DOOR_CL (in), DOOR_OP (in), DOOR_TR (out), HOOD_TR (out), IGN1_IN (out), IGN1_OUT (in), IGN2 (in), LIGHTS (in), MOTOR_CTRL (out), MOTOR_LOCK (in), SHOCK1 (out), SHOCK2 (out), SIREN (in), ST_IN (out), ST_OUT (in), TRUNK_TR (out)

### Nets
GND: C7.2 C8.2 C9.2 C10.2 C11.2 C12.2 C13.2 C14.2 C15.2 P3.1 Q1.2(S) Q2.2(S) Q3.2(S) Q5.2(S) Q6.2(S) Q7.2(S) Q8.3(S) Q10.2(S) Q12.2(S) R9.1 R10.1 R11.1 R19.1 R20.1 R21.1 R25.1 R37.1 R41.1 VD1.1(A) VD2.2(A) VD9.1(A) VD10.2(A) VD11.1(A) VD12.1(A) VD13.2(A) VD14.2(A) VD15.1(A) VD16.1(A) VD17.2(A) VD18.2(A) VD19.1(A) VD20.2(A) VD21.1(A) VD22.2(A) VD23.1(A) VD24.2(A)
VCC+12V: K1.2 K2.2 K3.2 K4.2 K5.2 P3.18 Q4.3(S) Q9.3(S) Q11.3(S) R12.2 R34.2 R38.2 VD3.1(K) VD4.1(K) VD5.1(K) VD6.1(K) VD7.1(K)
ACC: K3.3 P2.2
BRAKE_CTRL: P3.5 R27.1
DC_COM: K4.3 P3.4
DC_NC: K4.4 P3.2
DC_NO: K4.5 P3.6
DO_COM: K5.3 P3.10
DO_NC: K5.4 P3.8
DO_NO: K5.5 P3.12
DOOR_TR: P3.11 R31.1
HOOD_TR: P3.9 R28.1
IGN1: K1.3 P2.6
IGN2: K2.3 P2.4
IN+12V: K1.5 K2.5 K3.5 P2.1 VD8.1(K)
LIGHTS: P3.15 Q11.4(D)
M_LOCK: R15.2 ; port MOTOR_LOCK
MOTOR_CTRL: P3.3 R23.1
MOTOR_LOCK: P3.7 Q4.4(D)
SHOCK1: P3.16 R42.1
SHOCK2: P3.17 R45.1
SIREN: P3.14 Q9.4(D)
ST_IN: P2.5 R17.1
ST_OUT: P2.3 Q8.4(D) VD8.2(A)
TRUNK_TR: P3.13 R33.1
NetC7_1: C7.1 R5.2 VD1.3(K) ; port IGN1_IN
NetC8_1: C8.1 R18.2 VD9.3(K) ; port ST_IN
NetC9_1: C9.1 R24.2 VD11.3(K) ; port MOTOR_CTRL
NetC10_1: C10.1 R26.2 VD12.3(K) ; port BRAKE_CTRL
NetC11_1: C11.1 R29.2 VD15.3(K) ; port HOOD_TR
NetC12_1: C12.1 R30.2 VD16.3(K) ; port DOOR_TR
NetC13_1: C13.1 R32.2 VD19.3(K) ; port TRUNK_TR
NetC14_1: C14.1 R43.2 VD21.3(K) ; port SHOCK1
NetC15_1: C15.1 R44.2 VD23.3(K) ; port SHOCK2
NetK1_1: K1.1 Q1.3(D) VD3.2(A)
NetK1_4: K1.4 R4.1
NetK2_1: K2.1 Q2.3(D) VD4.2(A)
NetK3_1: K3.1 Q3.3(D) VD5.2(A)
NetK4_1: K4.1 Q5.3(D) VD6.2(A)
NetK5_1: K5.1 Q7.3(D) VD7.2(A)
NetQ1_1: Q1.1(G) R6.1 R9.2
NetQ2_1: Q2.1(G) R7.1 R10.2
NetQ3_1: Q3.1(G) R8.1 R11.2
NetQ4_1: Q4.1(G) R13.1
NetQ5_1: Q5.1(G) R14.1 R19.2
NetQ6_1: Q6.1(G) R15.1 R20.2
NetQ6_3: Q6.3(D) R12.1 R13.2
NetQ7_1: Q7.1(G) R16.1 R21.2
NetQ8_1: Q8.1(G) R22.1 R25.2
NetQ9_1: Q9.1(G) R35.1
NetQ10_1: Q10.1(G) R36.1 R37.2
NetQ10_3: Q10.3(D) R34.1 R35.2
NetQ11_1: Q11.1(G) R39.1
NetQ12_1: Q12.1(G) R40.1 R41.2
NetQ12_3: Q12.3(D) R38.1 R39.2
NetR4_2: R4.2 R5.1 VD2.1(K)
NetR6_2: R6.2 ; port IGN1_OUT
NetR7_2: R7.2 ; port IGN2
NetR8_2: R8.2 ; port ACC
NetR14_2: R14.2 ; port DOOR_CL
NetR16_2: R16.2 ; port DOOR_OP
NetR17_2: R17.2 R18.1 VD10.1(K)
NetR22_2: R22.2 ; port ST_OUT
NetR23_2: R23.2 R24.1 VD14.1(K)
NetR26_1: R26.1 R27.2 VD13.1(K)
NetR28_2: R28.2 R29.1 VD18.1(K)
NetR30_1: R30.1 R31.2 VD17.1(K)
NetR32_1: R32.1 R33.2 VD20.1(K)
NetR36_2: R36.2 ; port SIREN
NetR40_2: R40.2 ; port LIGHTS
NetR42_2: R42.2 R43.1 VD22.1(K)
NetR44_1: R44.1 R45.2 VD24.1(K)

Not connected (* = marked no-connect by the designer): K2 4; K3 4; VD1 2; VD9 2; VD11 2; VD12 2; VD15 2; VD16 2; VD19 2; VD21 2; VD23 2

### Notes on the sheet
- CAR ALARM_UNIT

### Library data of the parts
C7-C15 = Capasitor_SMD_0805: Capasitor_SMD_0808/
Q1-Q3 Q5-Q7 Q10 Q12 = BSS138-SOT23
Q4 Q9 Q11 = IRFR9024: HEXFET Power MOSFET; Note: Pin 2 is trimmed and is electrically connected to Drain.; Published: 8-Jun-2000; LatestRevisionDate: 20-Nov-2009; LatestRevisionNote: IPC-7351 Footprint Added.; DatasheetVersion: PD-9.655A; PackageVersion: Feb-2003; PackageReference: TO-252AA; Publisher: Altium Limited; PackageDescription: 3-Pin HEXFET Package 2.28 mm Pitch, 9.9 mm Lead Span; Code_JEDEC: TO-252-AA; ComponentLink1Description: Manufacturer Link; ComponentLink1URL: http://www.irf.com/; ComponentLink2Description: Datasheet; ComponentLink2URL: http://www.irf.com/product-info/datasheets/data/irfr9024.pdf
Q8 = IRLR024N: HEXFET Power MOSFET; Note: Pin 2 is trimmed and is electrically connected to Drain.; Published: 8-Jun-2000; LatestRevisionDate: 20-Nov-2009; LatestRevisionNote: IPC-7351 Footprint Added.; PackageVersion: Feb-2003; PackageReference: TO-252AA; Publisher: Altium Limited; PackageDescription: 3-Pin HEXFET Package 2.28 mm Pitch, 9.9 mm Lead Span; Code_JEDEC: TO-252-AA; ComponentLink1Description: Manufacturer Link; ComponentLink1URL: http://www.irf.com/; ComponentLink2Description: Datasheet; ComponentLink2URL: http://www.irf.com/product-info/datasheets/data/irlr024n.pdf
R4-R45 = RES: Resistor
VD1 VD9 VD11 VD12 VD15 VD16 VD19 VD21 VD23 = BZX84C: Value: *

## Nets that join several sheets
GND: MFU 1.00 (27 pins), POWER_UNIT (28 pins), GSM_UNIT (17 pins), NAVIGATION_UNIT (15 pins), BLUETOOTH_UNIT (18 pins), CAR ALARM_UNIT (46 pins)
VCC+1.8V: POWER_UNIT (5 pins), NAVIGATION_UNIT (C30.1 U8.22)
VCC+3.3V: MFU 1.00 (17 pins), POWER_UNIT (5 pins), GSM_UNIT (5 pins), NAVIGATION_UNIT (C29.1 C31.1 U8.21 U8.23), BLUETOOTH_UNIT (12 pins)
VCC+4.2V: POWER_UNIT (5 pins), GSM_UNIT (C17.1 U2.29 U2.30)
VCC+5V: MFU 1.00 (6 pins), POWER_UNIT (7 pins)
VCC+12V: POWER_UNIT (C36.1 R63.2 U11.1), CAR ALARM_UNIT (17 pins)
GSM_ON/OFF: MFU 1.00 (U7.8), GSM_UNIT (R51.1)
GSM_READY: MFU 1.00 (U7.10), GSM_UNIT (U2.7)
GSM_RESET: MFU 1.00 (U7.9), GSM_UNIT (R50.1)
GSM_RING: MFU 1.00 (U7.11), GSM_UNIT (U2.45)
M_LOCK: MFU 1.00 (U7.54), CAR ALARM_UNIT (R15.2)
NetC7_1: MFU 1.00 (U7.28), CAR ALARM_UNIT (C7.1 R5.2 VD1.3)
NetC8_1: MFU 1.00 (U7.58), CAR ALARM_UNIT (C8.1 R18.2 VD9.3)
NetC9_1: MFU 1.00 (U7.35), CAR ALARM_UNIT (C9.1 R24.2 VD11.3)
NetC10_1: MFU 1.00 (U7.36), CAR ALARM_UNIT (C10.1 R26.2 VD12.3)
NetC11_1: MFU 1.00 (U7.53), CAR ALARM_UNIT (C11.1 R29.2 VD15.3)
NetC12_1: MFU 1.00 (U7.52), CAR ALARM_UNIT (C12.1 R30.2 VD16.3)
NetC13_1: MFU 1.00 (U7.51), CAR ALARM_UNIT (C13.1 R32.2 VD19.3)
NetC14_1: MFU 1.00 (U7.39), CAR ALARM_UNIT (C14.1 R43.2 VD21.3)
NetC15_1: MFU 1.00 (U7.40), CAR ALARM_UNIT (C15.1 R44.2 VD23.3)
NetQ13_3: MFU 1.00 (U7.17), GSM_UNIT (Q13.3 R46.2)
NetQ14_3: MFU 1.00 (U7.16), GSM_UNIT (Q14.3 R47.2)
NetR6_2: MFU 1.00 (U7.57), CAR ALARM_UNIT (R6.2)
NetR7_2: MFU 1.00 (U7.61), CAR ALARM_UNIT (R7.2)
NetR8_2: MFU 1.00 (U7.62), CAR ALARM_UNIT (R8.2)
NetR14_2: MFU 1.00 (U7.25), CAR ALARM_UNIT (R14.2)
NetR16_2: MFU 1.00 (U7.24), CAR ALARM_UNIT (R16.2)
NetR22_2: MFU 1.00 (U7.59), CAR ALARM_UNIT (R22.2)
NetR36_2: MFU 1.00 (U7.38), CAR ALARM_UNIT (R36.2)
NetR40_2: MFU 1.00 (U7.37), CAR ALARM_UNIT (R40.2)
NetR57_1: MFU 1.00 (U7.29), NAVIGATION_UNIT (R57.1)
NetR58_1: MFU 1.00 (U7.30), NAVIGATION_UNIT (R58.1)
NetR59_1: MFU 1.00 (U7.33), NAVIGATION_UNIT (R59.1)
NetR60_1: MFU 1.00 (U7.34), NAVIGATION_UNIT (R60.1)
NetR63_1: MFU 1.00 (U7.26), POWER_UNIT (R63.1 R67.2 VD31.3)
NetR70_1: MFU 1.00 (U7.27), POWER_UNIT (R70.1 R71.2 VD32.3)
NetU1_2: MFU 1.00 (U7.41), BLUETOOTH_UNIT (U1.2)
NetU1_12: MFU 1.00 (U7.42), BLUETOOTH_UNIT (U1.12)
NetU1_13: MFU 1.00 (U7.43), BLUETOOTH_UNIT (U1.13)
SIM1: MFU 1.00 (U7.2), GSM_UNIT (U3.5 U3.6 U3.13)
SIM2: MFU 1.00 (U7.3), GSM_UNIT (U4.5 U4.6 U4.13)
SIM3: MFU 1.00 (U7.4), GSM_UNIT (U5.5 U5.6 U5.13)